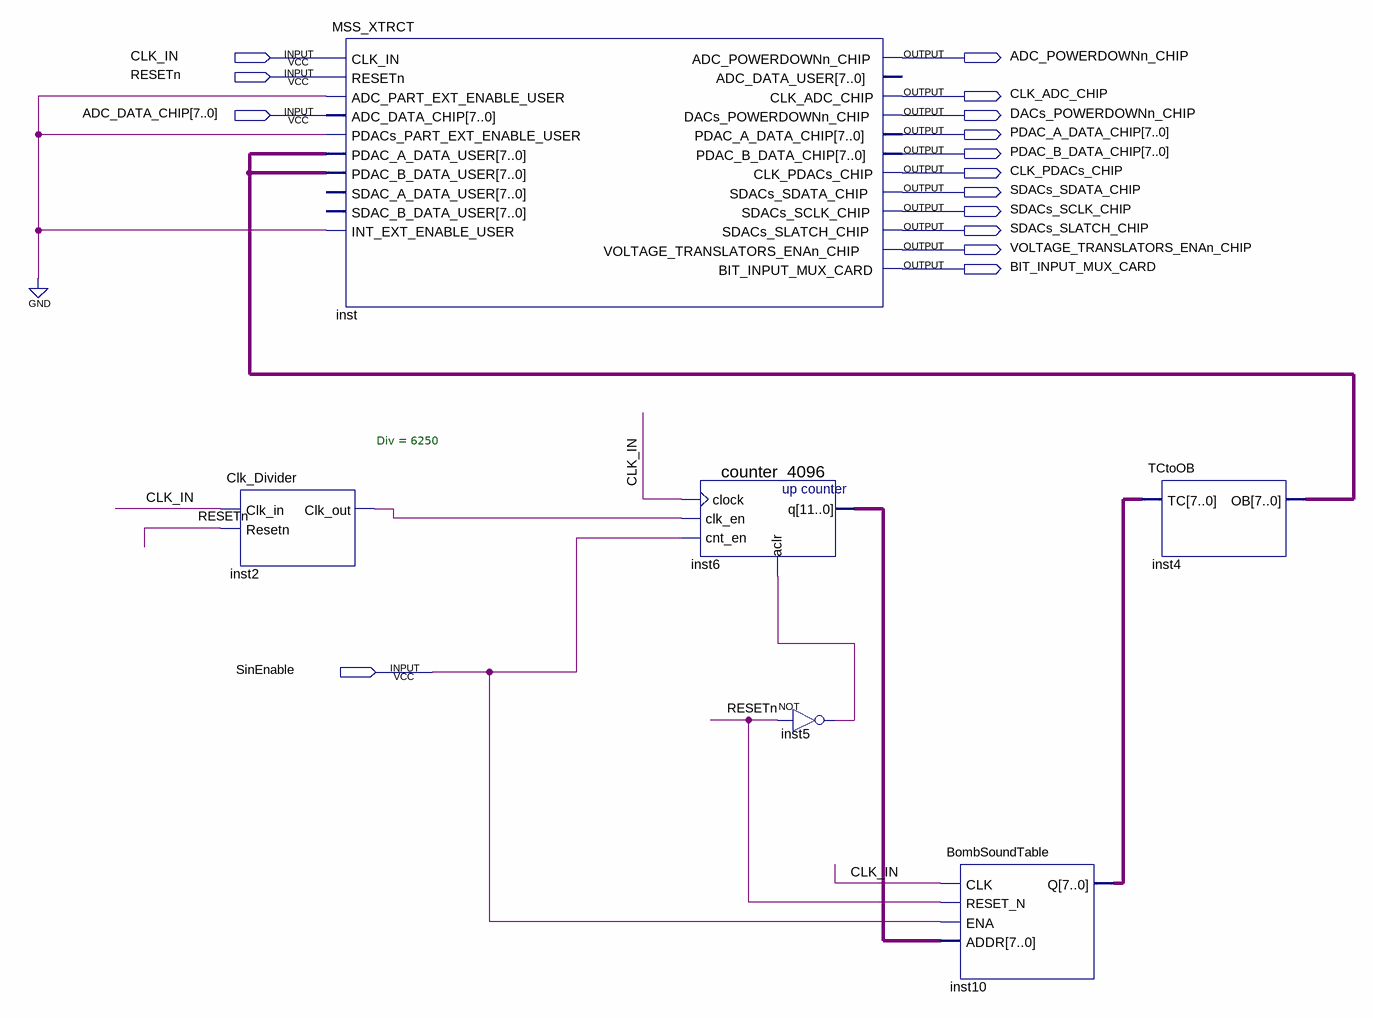
[diagram p0: schematic sheet]
// Quartus schematic MSS_BASIC.bdf as structural Verilog: 6 symbols, 15 pins
module MSS_BASIC (
  input  CLK_IN,
  input  RESETn,
  input  [7:0] ADC_DATA_CHIP,
  input  SinEnable,
  output ADC_POWERDOWNn_CHIP,
  output CLK_ADC_CHIP,
  output DACs_POWERDOWNn_CHIP,
  output [7:0] PDAC_A_DATA_CHIP,
  output [7:0] PDAC_B_DATA_CHIP,
  output CLK_PDACs_CHIP,
  output SDACs_SDATA_CHIP,
  output SDACs_SCLK_CHIP,
  output SDACs_SLATCH_CHIP,
  output VOLTAGE_TRANSLATORS_ENAn_CHIP,
  output BIT_INPUT_MUX_CARD
);

  wire inst2_clk_out, inst5_out;
  wire [7:0] inst4_ob, inst10_q;
  wire [11:0] inst6_q;

  Clk_Divider #(.Div(6250)) inst2 (.Clk_in(CLK_IN), .Resetn(RESETn), .Clk_out(inst2_clk_out));
  MSS_XTRCT inst (
    .CLK_IN(CLK_IN), .RESETn(RESETn), .ADC_PART_EXT_ENABLE_USER(1'b0), .ADC_DATA_CHIP(ADC_DATA_CHIP),
    .PDACs_PART_EXT_ENABLE_USER(1'b0), .PDAC_A_DATA_USER(inst4_ob), .PDAC_B_DATA_USER(inst4_ob),
    .INT_EXT_ENABLE_USER(1'b0), .ADC_POWERDOWNn_CHIP(ADC_POWERDOWNn_CHIP), .CLK_ADC_CHIP(CLK_ADC_CHIP),
    .DACs_POWERDOWNn_CHIP(DACs_POWERDOWNn_CHIP), .PDAC_A_DATA_CHIP(PDAC_A_DATA_CHIP),
    .PDAC_B_DATA_CHIP(PDAC_B_DATA_CHIP), .CLK_PDACs_CHIP(CLK_PDACs_CHIP),
    .SDACs_SDATA_CHIP(SDACs_SDATA_CHIP), .SDACs_SCLK_CHIP(SDACs_SCLK_CHIP),
    .SDACs_SLATCH_CHIP(SDACs_SLATCH_CHIP), .VOLTAGE_TRANSLATORS_ENAn_CHIP(VOLTAGE_TRANSLATORS_ENAn_CHIP),
    .BIT_INPUT_MUX_CARD(BIT_INPUT_MUX_CARD));  // open: SDAC_A_DATA_USER, SDAC_B_DATA_USER, ADC_DATA_USER
  counter_4096 inst6 (.clock(CLK_IN), .clk_en(inst2_clk_out), .cnt_en(SinEnable), .aclr(inst5_out), .q(inst6_q));
  not inst5 (inst5_out, RESETn);
  BombSoundTable inst10 (.CLK(CLK_IN), .RESET_N(RESETn), .ENA(SinEnable), .ADDR(inst6_q), .Q(inst10_q));
  TCtoOB inst4 (.TC(inst10_q), .OB(inst4_ob));
endmodule
